# Altium project Angle-Sensor.PrjPcb
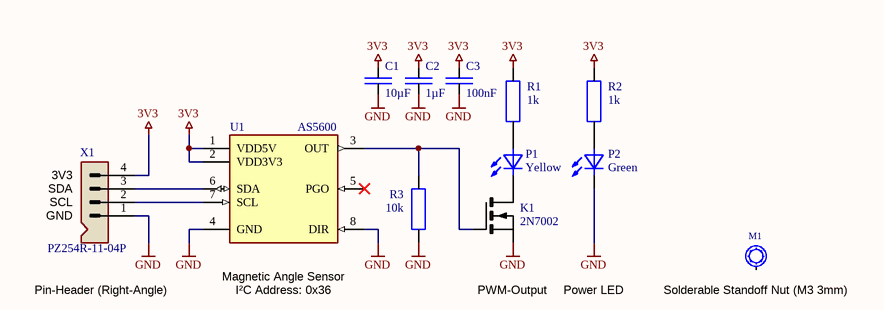
[diagram p0: Angle-Sensor_V1.0.SchDoc]
1 sheet, 12 parts. Net scope: global (net labels, ports and power ports of the same name join across sheets).
Board file: Angle-Sensor_V1.0.PcbDoc

## Sheet Angle-Sensor_V1.0.SchDoc: Angle-Sensor
size A4; PageSetup: Record=PageOptions|CenterHorizontal=True|CenterVertical=True|PrintScale=0.97|XCorrection=1.00|YCorrection=1.00|PrintKind=0|BorderSize=5000000|LeftOffset=0|BottomOffset=0|Orientation=2|PaperLength=1000|PaperWidth=1000|Scale=100|PaperSource=7|PrintQuality=-3|MediaType=1|DitherType=10|PrintScaleMode=1|PaperKind=A4|PaperIndex=9; Organization: Ostschweizer Fachhochschule; Address2: Florian Baumgartner & Alain Keller; Address3: florian.baumgartner@ost.ch; DocumentNumber: 1; Revision: V1.0; SheetNumber: 1; SheetTotal: 1; Author: Florian Baumgartner & Alain Keller; Subtitle: Vertically Mounted Daughter-Board

### Parts
C1  10µF  [SMD Keramikkondensator 1206]
C2  1µF  [SMD Keramikkondensator 0603]
C3  100nF  [SMD Keramikkondensator 0603]
K1  2N7002  [SMD MOSFET SOT-23]
M1  SMTSO-M3-3ET  [SMD Solder-Nut (M3 3mm)]  (value not drawn)
P1  Yellow  [SMD LED 0603]
P2  Green  [SMD LED 0603]
R1  1k  [SMD Widerstand 0603]
R2  1k  [SMD Widerstand 0603]
R3  10k  [SMD Widerstand 0603]
U1  AS5600  [SMD IC SOIC-8]
X1  PZ254R-11-04P  [THT Pin-Header 4x1 (90°)]

### Nets
3V3: C1.2 C2.2 C3.1 R1.2 R2.2 U1.1(VDD5V) U1.2(VDD3V3) X1.4
GND: C1.1 C2.1 C3.2 K1.S P2.K R3.1 U1.4(GND) U1.8(DIR) X1.1
NetK1_D: K1.D P1.K
NetK1_G: K1.G R3.2 U1.3(OUT)
NetP1_A: P1.A R1.1
NetP2_A: P2.A R2.1
NetU1_6: U1.6(SDA) X1.3
NetU1_7: U1.7(SCL) X1.2

Not connected (* = marked no-connect by the designer): M1 1; U1 5(PGO)*

### Notes on the sheet
- (near X1) 3V3
- (near X1) SDA
- (near X1) SCL
- (near X1) GND
- Pin-Header (Right-Angle)
- (near U1) Magnetic Angle Sensor
- I²C Address: 0x36
- PWM-Output
- Power LED
- (near M1) Solderable Standoff Nut (M3 3mm)
- Title
- Author:
- Subtitle
- Date:
- Rev:
- File:
- Sheet
- of

### Library data of the parts
C1 = E6 - 10uF: SMD Ceramic Capacitor E6; Component Value: 10µF 50V; Component Description: Multilayer Ceramic Capacitors MLCC; ComponentLink1Description: Datasheet; ComponentLink1URL: https://datasheet.lcsc.com/lcsc/1810191219_Samsung-Electro-Mechanics-CL10A106KP8NNNC_C19702.pdf; Digikey: 587-3258-1-ND; Farnell: 2113070; JLC-Parts: C13585; Mouser: 963-LMK107BBJ106MALT; Unit Price: 0.01
C2 = C-CAPACITOR: CAP-MK; Component Description: Multilayer Ceramic Capacitors; Component Value: 1µF 50V; Digikey: 1276-1860-1-ND; Farnell: 3013383; Mouser: 187-CL10A105KB8NNNC; JLC-Parts: C15849; Unit Price: 0.01
C3 = E6 - 100nF: SMD Ceramic Capacitor E6; Component Value: 100nF 50V; Component Description: Multilayer Ceramic Capacitors; ComponentLink1Description: Datasheet; ComponentLink1URL: https://datasheet.lcsc.com/lcsc/1809301912_YAGEO-CC0603KRX7R9BB104_C14663.pdf; Digikey: 445-5666-1-ND; Farnell: 2522432; JLC-Parts: C14663; Mouser: 77-VJ0603V104ZXAPBC; Unit Price: 0.01
K1 = K-FET:NIGE: MOSFET N-Channel; Digikey: 2N7002NCT-ND; Farnell: 1713823; Mouser: 512-2N7002; ComponentLink1Description: Datasheet; ComponentLink1URL: https://datasheet.lcsc.com/lcsc/1810151612_Jiangsu-Changjing-Electronics-Technology-Co---Ltd--2N7002_C8545.pdf; Component Description: MOSFET N-Channel; Component Value: 2N7002; JLC-Parts: C8545; Unit Price: 0.02
M1 = M-Spacer_M3_3mm: Solderable Standoff Nut; Component Value: M3 3mm; Mouser: 153-SMTSO-M3-3ET; Component Description: Solderable Standoff Nut; Unit Price: 0.05; JLC-Parts: C2915308; ComponentLink1Description: Datasheet; ComponentLink1URL: https://datasheet.lcsc.com/lcsc/2112061830_Sinhoo-SMTSO3030CTJ_C2915308.pdf
P1 = P-LED: LED (als Lampe E / alt H); Component Description: General Purpose LED; Component Value: Yellow (5mA, 2.1V); Digikey: 350-2033-1-ND; Farnell: 1867103; Mouser: 645-598-8050-107F; ComponentLink1Description: Datasheet; ComponentLink1URL: https://datasheet.lcsc.com/szlcsc/Everlight-Elec-19-213-Y2C-CQ2R2L-3T-CY_C72038.pdf; JLC-Parts: C72038; Unit Price: 0.34
P2 = LED Green 0603: General Purpose LED; Component Value: Green (5mA, 2.4V); Digikey: 350-2035-1-ND; Farnell: 1465991; Mouser: 645-598-8070-107F; Unit Price: 0.34; ComponentLink1Description: Datasheet; ComponentLink1URL: https://datasheet.lcsc.com/szlcsc/Everlight-Elec-19-217-GHC-YR1S2-3T_C72043.pdf; JLC-Parts: C72043; Component Description: General Purpose LED
R1 R2 = R-RESISTOR: RES (E=Heizwiderstand B=Messwandler); Component Description: Dickschicht Chipwiderstand; Component Value: 1k (75V, 100mW, 1%); Digikey: P1.00KHCT-ND; Farnell: 2303145; Mouser: 667-ERJ-3EKF1001V; JLC-Parts: C21190; Unit Price: 0.01
R3 = R-RESISTOR: RES (E=Heizwiderstand B=Messwandler); Component Description: Thick Film Chip Resistor; Component Value: 10k (75V, 100mW, 1%); Digikey: P10.0KHCT-ND; Farnell: 2303192; Mouser: 667-ERJ-3EKF1002V; JLC-Parts: C25804; Unit Price: 0.01
U1 = U-AS5600: Digital Magnetic Angle Sensor; ComponentLink1Description: Datasheet; ComponentLink1URL: https://ams.com/documents/20143/36005/AS5600_DS000365_5-00.pdf; Digikey: AS5600-ASOMCT-ND; Component Value: AS5600; Farnell: 4158625; JLC-Parts: C499458; Mouser: 985-AS5600-ASOM; Unit Price: 1.32; Component Description: Digital Magnetic Angle Sensor
X1 = X-Stiftleiste (4-Fach, Right-Angle): Pin Header (Right-Angle); Digikey: 952-3286-ND; Farnell: 3226010; Mouser: 855-M20-9960445; Component Description: Pin Header (Right-Angle); Component Value: PZ254R-11-04P; JLC-Parts: C492412; Unit Price: 0.02